# EAGLE design PWMFanController (EAGLE 8.3.1)
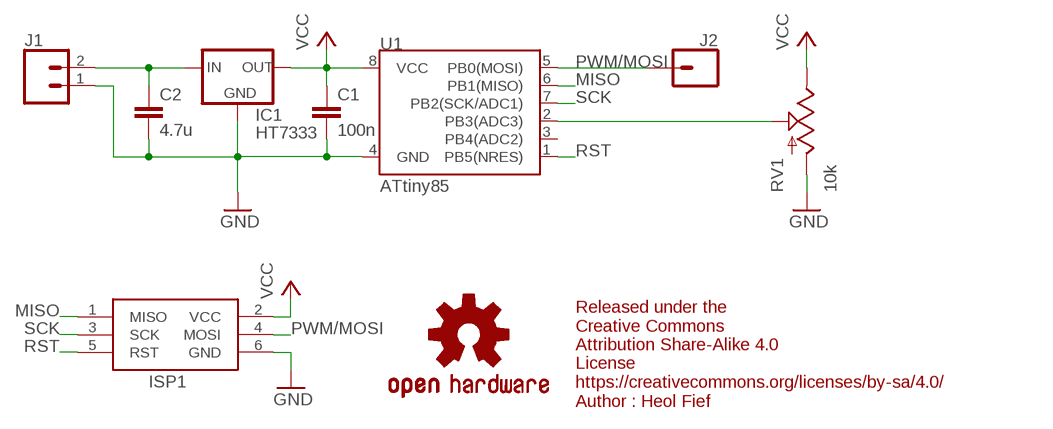
[diagram p0: schematic, sheet 1]

## Parts
C1  100n  C-EUC0805K  [C0805K]
C2  4.7u  C-EUC0805K  [C0805K]
IC1  HT7333  [SOT-89]
ISP1  AVRISP-6  [AVRISP]
J1  CONN_02  [1X02]
J2  CONN_01  [1X01]
LOGO1  OSHW-LOGOS-COPPER  [OSHW-LOGO-S_COPPER]
RV1  10k  POTMAM  [POT_MAMMOTH]
U1  ATtiny85  ATTINY45TINY85-20-SMT  [SO08-EIAJ_MCU]

## Nets
GND: C1.2 C2.2 IC1.2(GND) ISP1.6(GND) J1.1 RV1.P$1(A) U1.4(GND)
MISO: ISP1.1(MISO) U1.6(PB1(MISO))
N$1: C2.1 IC1.3(IN) IC1.4(IN) J1.2
N$2: RV1.P$2(S) U1.2(PB3(ADC3))
PWM/MOSI: ISP1.4(MOSI) J2.1 U1.5(PB0(MOSI))
RST: ISP1.5(RST) U1.1(PB5(NRES))
SCK: ISP1.3(SCK) U1.7(PB2(SCK/ADC1))
VCC: C1.1 IC1.1(OUT) ISP1.2(VCC) RV1.P$3(E) U1.8(VCC)
Unconnected: U1.3(PB4(ADC2))

## Notes on the sheet
- Released under the 
  Creative Commons
  Attribution Share-Alike 4.0 
  License 
  https://creativecommons.org/licenses/by-sa/4.0/
- Author : Heol Fief

## Library data of the parts
C1 C2 = rcl:C-EU: CAPACITOR, European symbol
IC1 = holtek2:HT73*
ISP1 = adafruit:AVRISP: AVR ISP HEADER Standard 6 pin header for AVR programming
J1 = SparkFun-Connectors:CONN_02: Multi connection point. Often used as Generic Header-pin footprint for 0.1 inch spaced/style header connections On any of the 0.1 inch spaced packages, you can populate with these: Break Away Headers - Straight <https://www.sparkfun.com/products/116> (PRT-00116) Break Away Male Headers - Right Angle <https://www.sparkfun.com/products/553> (PRT-00553) Female Headers <https://www.sparkfun.com/products/115> (PRT-00115) Break Away Headers - Machine Pin <https://www.sparkfun.com/products/117> (PRT-00117) Break Away Female Headers - Swiss Machine Pin <https://www.sparkfun.com/products/743> (PRT-00743) For SCREWTERMINALS and SPRING TERMINALS visit here: Screw Terimnals on SparkFun.com <https://www.sparkfun.com/search/results?term=Screw+Terminals> (5mm/3.5mm/2.54mm spacing) This device is also useful as a general connection point to wire up your design to another part of your project. Our various solder wires solder well into these plated through hole pads. Hook-Up Wire - Assortment (Stranded, 22 AWG) <https://www.sparkfun.com/products/11375> (PRT-11375) Hook-Up Wire - Assortment (Solid Core, 22 AWG) <https://www.sparkfun.com/products/11367> (PRT-11367) View the entire wire category on our website here <https://www.sparkfun.com/categories/141> Special notes: Molex polarized connector foot print use with: PRT-08233 with associated crimp pins and housings. 2.54_SCREWTERM for use with PRT-10571. 3.5mm Screw Terminal footprints for PRT-08084 5mm Screw Terminal footprints for use with PRT-08432
J2 = SparkFun-Connectors:CONN_01: Single connection point. Often used as Generic Header-pin footprint for 0.1 inch spaced/style header connections On any of the 0.1 inch spaced packages, you can populate with these: Break Away Headers - Straight <https://www.sparkfun.com/products/116> (PRT-00116) Break Away Male Headers - Right Angle <https://www.sparkfun.com/products/553> (PRT-00553) Female Headers <https://www.sparkfun.com/products/115> (PRT-00115) Break Away Headers - Machine Pin <https://www.sparkfun.com/products/117> (PRT-00117) Break Away Female Headers - Swiss Machine Pin <https://www.sparkfun.com/products/743> (PRT-00743) This device is also useful as a general connection point to wire up your design to another part of your project. Our various solder wires solder well into these plated through hole pads. Hook-Up Wire - Assortment (Stranded, 22 AWG) <https://www.sparkfun.com/products/11375> (PRT-11375) Hook-Up Wire - Assortment (Solid Core, 22 AWG) <https://www.sparkfun.com/products/11367> (PRT-11367) View the entire wire category on our website here <https://www.sparkfun.com/categories/141> Special notes: SMTSO-256-ET is a "flush mount" nut for a 4-40 screw. We mostly use this on specialty testbeds; it is a nice way to connect hardware to your PCB at an adjustable hieght. Also note, the SNAP packages are for using a snappable style connector. We sell a baggie of snaps and they are also used on two LilyPad designs: Snap Assortment - 30 pack (male and female) <https://www.sparkfun.com/products/11347> (DEV-11347) LilyPad Arduino SimpleSnap <https://www.sparkfun.com/products/10941> (DEV-10941) LilyPad SimpleSnap Protoboard <https://www.sparkfun.com/products/10940> (DEV-10940)
LOGO1 = SparkFun-Aesthetics:OSHW-LOGO: Open-Source Hardware (OSHW) Logo This logo indicates the piece of hardware it is found on incorporates a OSHW license and/or adheres to the definition of open source hardware found here: http://freedomdefined.org/OSHW
RV1 = SparkFun-Retired:POT
U1 = SparkFun-Retired:ATTINY45: Atmel 8-pin 2/4/8kB flash uC Retired; PROD_ID: IC-09092; VALUE: Tiny85-20-SMT

## Board
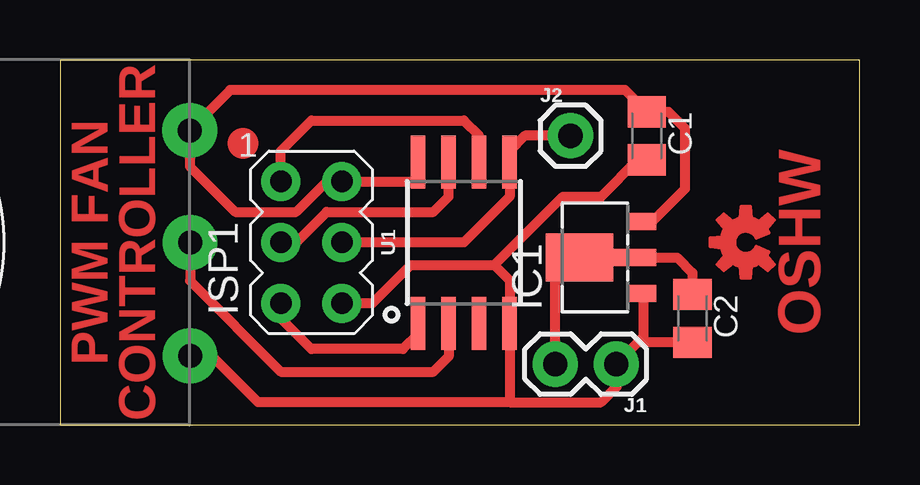
[diagram p1: board, top side]

Size 33.32 x 15.23 mm. Coordinates in mm from the lower left corner, seen from the top.
Outline: 0,0 33.32,0 33.32,15.23 0,15.23 0,0
Copper layers (1*16): Top 0.035mm / dielectric 1.5mm / Bottom 0.035mm
Design rules "default *": minimum track width 6mil, minimum drill 0.35mm, track to track 6mil, track to pad 6mil, pad to pad 6mil, via to via 6mil, smd to smd 6mil, copper to edge 20mil, drill to drill 6mil, minimum pad ring 10mil, minimum via ring 8mil, stop-mask expansion 4mil, vias tented up to drill 0mil, thermal gap 10mil

### Footprints (pad centres in the part's own frame; a part is rotated, then mirrored left to right if it is on the bottom)
C0805K = smd 1.3 x 1.6: 1 -1,0; 2 1,0
SOT-89 = smd 0.7 x 1.1: 1 1.5,-2.385; 2 -1.5,-2.385 | smd 0.7 x 1.8: 3 0,-2.035 | smd 2 x 2.8: 4 0,0.265
AVRISP = drill 0.9 pad 1.626: 1 -1.27,2.54; 2 1.27,2.54; 3 -1.27,0; 4 1.27,0; 5 -1.27,-2.54; 6 1.27,-2.54
1X02 = drill 1.016 pad 1.88: 1 0,0; 2 2.54,0
1X01 = drill 1.016 pad 1.88: 1 0,0
POT_MAMMOTH = drill 1 pad 2.286: P$1 -4.73,-0.02; P$2 0,-0.02; P$3 4.67,-0.01
SO08-EIAJ_MCU = smd 0.61 x 2.21: 1 -1.905,-3.378; 2 -0.635,-3.378; 3 0.635,-3.378; 4 1.905,-3.378; 5 1.905,3.353; 6 0.635,3.353; 7 -0.635,3.353; 8 -1.905,3.353

### Placement (x,y rotation side)
C1  24.45,12.06 270 top
C2  26.35,4.45 270 top
IC1  21.91,6.99 90 top
ISP1  10.48,7.62 0 top
J1  23.18,2.54 180 top
J2  21.27,12.06 0 top
LOGO1  28.57,7.62 90 top
RV1  5.4,7.62 90 top
U1  16.83,7.62 0 top

### Tracks (layer width: path | path; a pad name or v marks a point on that pad's centre or on a via)
GND
  Top 0.406: ISP1.6 13.02,5.08 14.61,6.67 18.1,6.67 | 18.1,6.67 18.73,6.03 U1.4 18.73,0.95 | 18.73,0.95 22.54,0.95 23.18,1.59 J1.1 24.08,3.44 | IC1.2 24.29,3.65 24.08,3.44 | C1.2 24.08,11.06 22.54,9.53 20.95,9.53 18.1,6.67 | C2.2 24.08,3.44 | RV1.P$1 6.32,2.89 8.26,0.95 18.73,0.95
MISO
  Top 0.406: ISP1.1 9.21,11.43 10.48,12.7 16.83,12.7 17.46,12.06 U1.6
N$1
  Top 0.406: J1.2 20.64,5.98 IC1.4 IC1.3 25.72,6.99 26.35,6.35 C2.1
N$2
  Top 0.406: U1.2 16.19,2.86 15.56,2.22 9.21,2.22 5.42,6.01 RV1.P$2
PWM/MOSI
  Top 0.406: ISP1.4 16.83,7.62 18.73,9.53 U1.5 18.73,11.43 19.37,12.06 J2.1
RST
  Top 0.406: ISP1.5 9.21,4.45 10.48,3.17 14.29,3.17 14.92,3.81 U1.1
SCK
  Top 0.406: U1.7 16.19,9.53 15.56,8.89 11.11,8.89 9.84,7.62 ISP1.3
VCC
  Top 0.406: 5.41,12.05 RV1.P$3 | U1.8 14.92,10.16 ISP1.2 11.11,10.16 9.84,8.89 7.3,8.89 5.41,10.79 RV1.P$3 | IC1.1 24.68,8.48 26.04,9.84 26.04,12.38 25.35,13.06 C1.1 23.54,13.97 7.09,13.97 RV1.P$3
(copper drawn outside any net)
  shapes: Top circle x1

### Text on the board
Top: PWM FAN / CONTROLLER | OSHW
Notes: Released under the Creative Commons / Attribution Share-Alike 4.0 License / https://creativecommons.org/licenses/by-sa/4.0/